# Altium schematic sheet LCD.SchDoc
size A; SheetNumber: 4; SheetTotal: 8
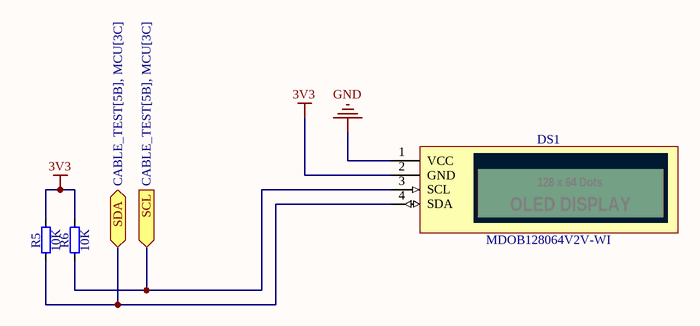
[diagram p0: LCD.SchDoc]

## Parts
DS1  MDOB128064V2V-WI  [DS_MIDAS_MDOB128064V2V-WI]
R5  10K  [RESC2012X60N]
R6  10K  [RESC2012X60N]

## Ports
SCL (in, see CABLE_TEST[5B], MCU[3C]), SDA (bidir, see CABLE_TEST[5B], MCU[3C])

## Nets
3V3: DS1.2(GND) R5.2 R6.2
GND: DS1.1(VCC)
SCL: DS1.3(SCL) R6.1 ; port SCL
SDA: DS1.4(SDA) R5.1 ; port SDA

## Notes on the sheet
- (in symbol DS_MIDAS_MDOB128064V2V-WI) 128 x 64 Dots; OLED DISPLAY

## Library data of the parts
DS1 = DS_MIDAS_MDOB128064V2V-WI: LCD Display, Display Color White, I2C Bus Data Interface, 128 x 64 Dots Matrix; Manufacturer: MIDAS DISPLAY; PressFit: No; Sense Comment: Manual Soldering and Non-washable; Bonding: No; Status Comment: Sensitive (See Sensitive Field); Part Number: DS_MIDAS_MDOB128064V2V-WI; Component Kind: Standard; Component Type: Standard; Device: MDOB128064V2V-WI; PackageDescription: LCD Display Module, 128 x 64 Dots Matrix, Body 27.3x27.3mm; Part Description: LCD Display, Display Color White, I2C Bus Data Interface, 128 x 64 Dots Matrix; Manufacturer Part Number: MDOB128064V2V-WI; Pin Count: 4; Mounted: Yes; Socket: No; SMD: No; Sense: Yes; ComponentHeight: 3.87mm; HelpURL: \\cern.ch\dfs\Applications\Altium\Datasheets\DS_MIDAS_MDOB128064V2V-WI.pdf; Author: CERN DEM BC; CreateDate: 1/27/2020; LatestRevisionDate: 1/27/2020
R5 R6 = R0805_24K_1%_0.125W_100PPM: Resistor - 1%; Part Description: General Purpose Thick Film Chip Resistor; Manufacturer: GENERIC; Manufacturer1 Part Number: NRC10F2402TRF; Power: 0.125W; TC: ±100ppm/°C; PressFit: No; Part Number: R0805_24K_1%_0.125W_100PPM; Component Kind: Standard; Component Type: Standard; Pin Count: 2; Value: 10K; Status: Preferred; Tolerance: ±1%; Manufacturer Part Number: R0805_24K_1%_0.125W_100PPM; Case: 0805; Mounted: Yes; Sense: No; Socket: No; SMD: Yes; HelpURL: \\cern.ch\dfs\Applications\Altium\Datasheets\R0805_NIC_NRC.pdf; Author: CERN DEM JLC; CreateDate: 12/3/2007; LatestRevisionDate: 3/13/2008; Manufacturer1 Example: NIC COMPONENT; Manufacturer1 ComponentHeight: 0.6mm